# Altium schematic sheet Melon-2.SchDoc
size 594 x 420 mm; ApprovedBy: Лазарев В.П.; DrawnBy: Лазарев В.П.; SheetTotal: 1; PageSetup: Record=PageOptions|CenterHorizontal=True|CenterVertical=True|PrintScale=1.00|XCorrection=1.00|YCorrection=1.00|PrintKind=0|BorderSize=5000000|LeftOffset=0|BottomOffset=0|Orientation=2|PaperLength=1000|PaperWidth=1000|Scale=100|PaperSource=260|PrintQuality=600|MediaType=1|DitherType=10|PaperKind=A3|PrintScaleMode=0
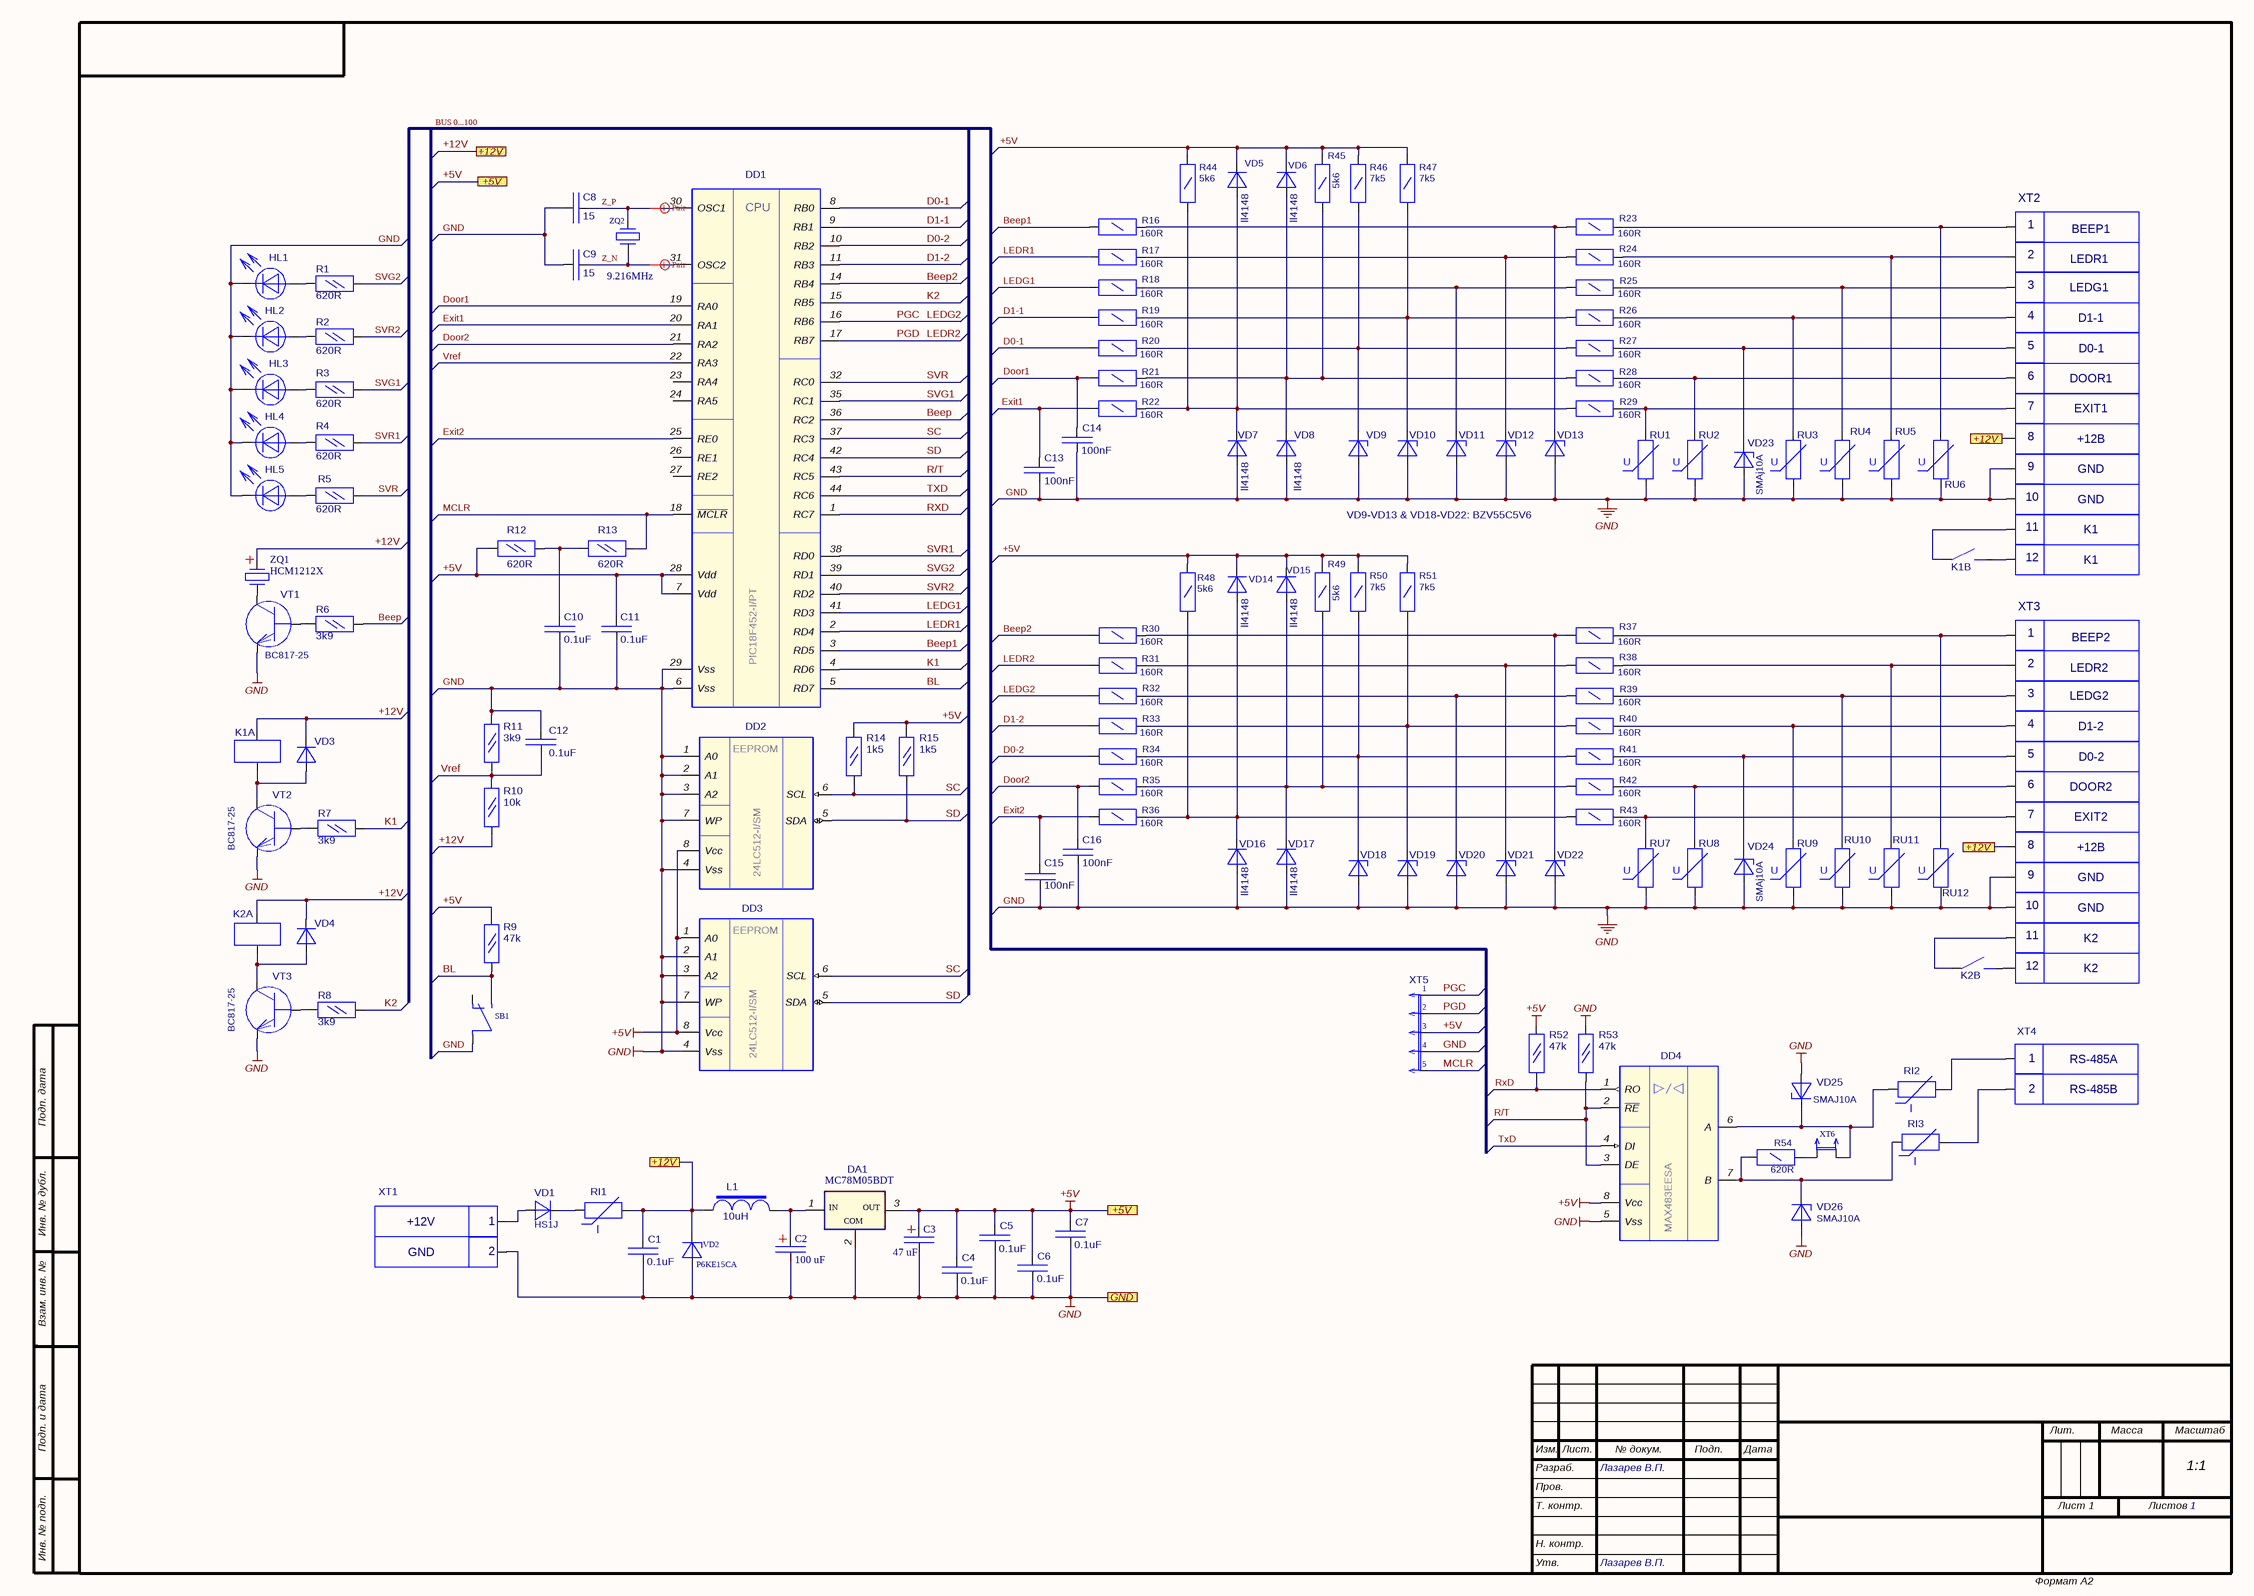
[diagram p0: Melon-2.SchDoc]

## Parts
C1  value 0.1uF  [CAPC2012 (0805)]  (hidden comment: Cap1)
C2  value 100 uF  [CAPR E 6.5x12, pitch 2.5]  (hidden comment: Comment)
C3  value 47 uF  [CAPR E 6.5x12, pitch 2.5]  (hidden comment: Comment)
C4  value 0.1uF  [CAPC2012 (0805)]  (hidden comment: Cap1)
C5  value 0.1uF  [CAPC2012 (0805)]  (hidden comment: Cap1)
C6  value 0.1uF  [CAPC2012 (0805)]  (hidden comment: Cap1)
C7  value 0.1uF  [CAPC2012 (0805)]  (hidden comment: Cap1)
C8  value 15  [1608[0603]]  (hidden comment: Cap_SMD)
C9  value 15  [1608[0603]]  (hidden comment: Cap_SMD)
C10  value 0.1uF  [CAPC2012 (0805)]  (hidden comment: Cap_SMD)
C11  value 0.1uF  [CAPC2012 (0805)]  (hidden comment: Cap_SMD)
C12  value 0.1uF  [1608[0603]]  (hidden comment: Cap_SMD)
C13  value 100nF  [CAPC2012 (0805)]  (hidden comment: Cap1)
C14  value 100nF  [CAPC2012 (0805)]  (hidden comment: Cap1)
C15  value 100nF  [CAPC2012 (0805)]  (hidden comment: Cap1)
C16  value 100nF  [CAPC2012 (0805)]  (hidden comment: Cap1)
DA1  MC78M05BDT  [D3PAK]
DD1  PIC18F452-I/PT  [TQFP-PT44_M]
DD2  24LC512-I/SM  [SO8_W]
DD3  24LC512-I/SM  [SO8_W]
DD4  value MAX483EESA  [SO8_M]  (hidden comment: MAX48xx)
HL1  LED Green  [LED Green smd-1206]  (value not drawn)
HL2  LED Red  [LED Red smd-1206]  (value not drawn)
HL3  LED Green  [LED Green smd-1206]  (value not drawn)
HL4  LED Red  [LED Red smd-1206]  (value not drawn)
HL5  LED Red  [LED Red smd-1206]  (value not drawn)
K1  Relay  [Relay TRC-12VDC-SB-AL]  (value not drawn)  (parts A,B of 2)
K2  Relay  [Relay TRC-12VDC-SB-AL]  (value not drawn)  (parts A,B of 2)
L1  Inductance: 10uH  [Choke SMD 1812]  (hidden comment: Choke SMD)
R1  value 620R  [RESC2012(0805)]  (hidden comment: Res 1/8W)
R2  value 620R  [RESC2012(0805)]  (hidden comment: Res 1/8W)
R3  value 620R  [RESC2012(0805)]  (hidden comment: Res 1/8W)
R4  value 620R  [RESC2012(0805)]  (hidden comment: Res 1/8W)
R5  value 620R  [RESC2012(0805)]  (hidden comment: Res 1/8W)
R6  value 3k9  [RESC2012(0805)]  (hidden comment: Res 1/8W)
R7  value 3k9  [RESC2012(0805)]  (hidden comment: Res 1/8W)
R8  value 3k9  [RESC2012(0805)]  (hidden comment: Res 1/8W)
R9  value 47k  [RESC2012(0805)]  (hidden comment: Res 1/8W)
R10  value 10k  [RESC2012(0805)]  (hidden comment: Res 1/8W)
R11  value 3k9  [RESC2012(0805)]  (hidden comment: Res 1/8W)
R12  value 620R  [RESC2012(0805)]  (hidden comment: Res 1/8W)
R13  value 620R  [RESC2012(0805)]  (hidden comment: Res 1/8W)
R14  value 1k5  [RESC2012(0805)]  (hidden comment: Res 1/8W)
R15  value 1k5  [RESC2012(0805)]  (hidden comment: Res 1/8W)
R16  value 160R  [RESC3216(1206)N]  (hidden comment: Res 1/4W)
R17  value 160R  [RESC3216(1206)N]  (hidden comment: Res 1/4W)
R18  value 160R  [RESC3216(1206)N]  (hidden comment: Res 1/4W)
R19  value 160R  [RESC3216(1206)N]  (hidden comment: Res 1/4W)
R20  value 160R  [RESC3216(1206)N]  (hidden comment: Res 1/4W)
R21  value 160R  [RESC3216(1206)N]  (hidden comment: Res 1/4W)
R22  value 160R  [RESC3216(1206)N]  (hidden comment: Res 1/4W)
R23  value 160R  [RESC3216(1206)N]  (hidden comment: Res 1/4W)
R24  value 160R  [RESC3216(1206)N]  (hidden comment: Res 1/4W)
R25  value 160R  [RESC3216(1206)N]  (hidden comment: Res 1/4W)
R26  value 160R  [RESC3216(1206)N]  (hidden comment: Res 1/4W)
R27  value 160R  [RESC3216(1206)N]  (hidden comment: Res 1/4W)
R28  value 160R  [RESC3216(1206)N]  (hidden comment: Res 1/4W)
R29  value 160R  [RESC3216(1206)N]  (hidden comment: Res 1/4W)
R30  value 160R  [RESC3216(1206)N]  (hidden comment: Res 1/4W)
R31  value 160R  [RESC3216(1206)N]  (hidden comment: Res 1/4W)
R32  value 160R  [RESC3216(1206)N]  (hidden comment: Res 1/4W)
R33  value 160R  [RESC3216(1206)N]  (hidden comment: Res 1/4W)
R34  value 160R  [RESC3216(1206)N]  (hidden comment: Res 1/4W)
R35  value 160R  [RESC3216(1206)N]  (hidden comment: Res 1/4W)
R36  value 160R  [RESC3216(1206)N]  (hidden comment: Res 1/4W)
R37  value 160R  [RESC3216(1206)N]  (hidden comment: Res 1/4W)
R38  value 160R  [RESC3216(1206)N]  (hidden comment: Res 1/4W)
R39  value 160R  [RESC3216(1206)N]  (hidden comment: Res 1/4W)
R40  value 160R  [RESC3216(1206)N]  (hidden comment: Res 1/4W)
R41  value 160R  [RESC3216(1206)N]  (hidden comment: Res 1/4W)
R42  value 160R  [RESC3216(1206)N]  (hidden comment: Res 1/4W)
R43  value 160R  [RESC3216(1206)N]  (hidden comment: Res 1/4W)
R44  value 5k6  [RESC3216(1206)N]  (hidden comment: Res 1/4W)
R45  value 5k6  [RESC3216(1206)N]  (hidden comment: Res 1/4W)
R46  value 7k5  [RESC3216(1206)N]  (hidden comment: Res 1/4W)
R47  value 7k5  [RESC3216(1206)N]  (hidden comment: Res 1/4W)
R48  value 5k6  [RESC3216(1206)N]  (hidden comment: Res 1/4W)
R49  value 5k6  [RESC3216(1206)N]  (hidden comment: Res 1/4W)
R50  value 7k5  [RESC3216(1206)N]  (hidden comment: Res 1/4W)
R51  value 7k5  [RESC3216(1206)N]  (hidden comment: Res 1/4W)
R52  value 47k  [RESC2012(0805)]  (hidden comment: Res 1/8W)
R53  value 47k  [RESC2012(0805)]  (hidden comment: Res 1/8W)
R54  value 620R  [RESC3216(1206)N]  (hidden comment: Res 1/4W)
RI1  MF-MSMF010  [Multy_Fuse 1812]  (value not drawn)
RI2  MF-MSMF010  [Multy_Fuse 1812]  (value not drawn)
RI3  MF-MSMF010  [Multy_Fuse 1812]  (value not drawn)
RU1  Varistor  [CAPC3216N]  (value not drawn)
RU2  Varistor  [CAPC3216N]  (value not drawn)
RU3  Varistor  [CAPC3216N]  (value not drawn)
RU4  Varistor  [CAPC3216N]  (value not drawn)
RU5  Varistor  [CAPC3216N]  (value not drawn)
RU6  Varistor  [CAPC3216N]  (value not drawn)
RU7  Varistor  [CAPC3216N]  (value not drawn)
RU8  Varistor  [CAPC3216N]  (value not drawn)
RU9  Varistor  [CAPC3216N]  (value not drawn)
RU10  Varistor  [CAPC3216N]  (value not drawn)
RU11  Varistor  [CAPC3216N]  (value not drawn)
RU12  Varistor  [CAPC3216N]  (value not drawn)
SB1  SW-2WAY_Gost  [PLS 2pin]  (value not drawn)
VD1  value HS1J  [CD4532-1812 (mod)]  (hidden comment: Diode1)
VD2  value P6KE15CA  [DO-15 -12.5mm Pitch]  (hidden comment: Diode P6KE15CA)
VD3  Diode LL4148  [MELF-D3516-1406]  (value not drawn)
VD4  Diode LL4148  [MELF-D3516-1406]  (value not drawn)
VD5  value ll4148  [MELF-D3516-1406]  (hidden comment: Diode LL4148)
VD6  value ll4148  [MELF-D3516-1406]  (hidden comment: Diode LL4148)
VD7  value ll4148  [MELF-D3516-1406]  (hidden comment: Diode LL4148)
VD8  value ll4148  [MELF-D3516-1406]  (hidden comment: Diode LL4148)
VD9  Diode Zener  [SOD80 (miniMELF]  (value not drawn)
VD10  Diode Zener  [SOD80 (miniMELF]  (value not drawn)
VD11  Diode Zener  [SOD80 (miniMELF]  (value not drawn)
VD12  Diode Zener  [SOD80 (miniMELF]  (value not drawn)
VD13  Diode Zener  [SOD80 (miniMELF]  (value not drawn)
VD14  value ll4148  [MELF-D3516-1406]  (hidden comment: Diode LL4148)
VD15  value ll4148  [MELF-D3516-1406]  (hidden comment: Diode LL4148)
VD16  value ll4148  [MELF-D3516-1406]  (hidden comment: Diode LL4148)
VD17  value ll4148  [MELF-D3516-1406]  (hidden comment: Diode LL4148)
VD18  Diode Zener  [SOD80 (miniMELF]  (value not drawn)
VD19  Diode Zener  [SOD80 (miniMELF]  (value not drawn)
VD20  Diode Zener  [SOD80 (miniMELF]  (value not drawn)
VD21  Diode Zener  [SOD80 (miniMELF]  (value not drawn)
VD22  Diode Zener  [SOD80 (miniMELF]  (value not drawn)
VD23  value SMAj10A  [SMA (DO-214AC)]  (hidden comment: Diode Zener)
VD24  value SMAj10A  [SMA (DO-214AC)]  (hidden comment: Diode Zener)
VD25  value SMAJ10A  [SMA (DO-214AC)]  (hidden comment: Diode Zener)
VD26  value SMAJ10A  [SMA (DO-214AC)]  (hidden comment: Diode Zener)
VT1  value BC817-25  [SOT-23_3D]  (hidden comment: BC847)
VT2  value BC817-25  [SOT-23_3D]  (hidden comment: BC847)
VT3  value BC817-25  [SOT-23_3D]  (hidden comment: BC847)
X2.2  Connect x2_1  [ZIP-Ballast2 - screw 3.5]  (value not drawn)
XT1  Connect x2_1  [ZIP-Ballast2]  (value not drawn)
XT2  Connect x2_1  [ZIP-Ballast2 - screw 3.5]  (value not drawn)
XT2.1  Connect x2_1  [ZIP-Ballast2 - screw 3.5]  (value not drawn)
XT2.3  Connect x2_1  [ZIP-Ballast2 - screw 3.5]  (value not drawn)
XT2.4  Connect x2_1  [ZIP-Ballast2 - screw 3.5]  (value not drawn)
XT2.5  Connect x2_1  [ZIP-Ballast2]  (value not drawn)
XT3  Connect x2_1  [ZIP-Ballast2 - screw 3.5]  (value not drawn)
XT3.1  Connect x2_1  [ZIP-Ballast2 - screw 3.5]  (value not drawn)
XT3.2  Connect x2_1  [ZIP-Ballast2 - screw 3.5]  (value not drawn)
XT3.3  Connect x2_1  [ZIP-Ballast2 - screw 3.5]  (value not drawn)
XT3.4  Connect x2_1  [ZIP-Ballast2 - screw 3.5]  (value not drawn)
XT3.5  Connect x2_1  [ZIP-Ballast2]  (value not drawn)
XT4  Connect x2_1  [ZIP-Ballast2 - screw 3.5]  (value not drawn)
XT5  Connect x5  [Connector PLS 5pin]  (value not drawn)
XT6  Connect x2  [PLS 2pin]  (value not drawn)
ZQ1  value HCM1212X  [HCM1606X]  (hidden comment: Buzzer)
ZQ2  value 9.216MHz  [HC-49sm]  (hidden comment: XTAL_1)

## Ports
+5V, +12V, GND

## Nets
+5V: C3.1 C4.2 C5.2 C6.2 C7.2 C11.2 DA1.3(OUT) DD1.7(Vdd) DD1.28(Vdd) DD2.8(Vcc) DD3.1(A0) DD3.8(Vcc) DD4.8(Vcc) R9.1 R12.2 R14.1 R15.1 R44.1 R45.1 R46.1 R47.1 R48.1 R49.1 R50.1 R51.1 R52.1 VD5.2 VD6.2 VD14.2 VD15.2 XT5.3 ; port +5V
GND: C1.1 C2.2 C3.2 C4.1 C5.1 C6.1 C7.1 C8.1 C9.1 C10.1 C11.1 C12.1 C13.1 C14.1 C15.1 C16.1 DA1.2(COM) DD1.6(Vss) DD1.29(Vss) DD2.1(A0) DD2.2(A1) DD2.3(A2) DD2.4(Vss) DD2.7(WP) DD3.2(A1) DD3.3(A2) DD3.4(Vss) DD3.7(WP) DD4.5(Vss) HL1.2 HL2.2 HL3.2 HL4.2 HL5.2 R11.1 R53.1 RU1.1 RU2.1 RU3.1 RU4.1 RU5.1 RU6.1 RU7.1 RU8.1 RU9.1 RU10.1 RU11.1 RU12.1 SB1.1(C) VD2.1 VD7.1 VD8.1 VD9.1 VD10.1 VD11.1 VD12.1 VD13.1 VD16.1 VD17.1 VD18.1 VD19.1 VD20.1 VD21.1 VD22.1 VD23.1 VD24.1 VD25.1 VD26.1 VT1.2(E) VT2.2(E) VT3.2(E) XT1.1 XT2.4.1 XT2.4.2 XT3.4.1 XT3.4.2 XT5.4 ; port GND
+12V: C1.2 K1.4 K2.4 L1.2 R10.2 RI1.1 VD2.2 VD3.2 VD4.2 XT2.3.2 XT3.3.2 ZQ1.1(OSC1) ; port +12V
Beep: DD1.36(RC2) R6.2
Beep1: DD1.3(RD5) R16.2
Beep2: DD1.14(RB4) R30.2
BL: DD1.5(RD7) R9.2 SB1.2(NO)
D0-1: DD1.8(RB0) R20.2
D0-2: DD1.10(RB2) R34.2
D1-1: DD1.9(RB1) R19.2
D1-2: DD1.11(RB3) R33.2
Door1: C14.2 DD1.19(RA0) R21.2
Door2: C16.2 DD1.21(RA2) R35.2
Exit1: C13.2 DD1.20(RA1) R22.2
Exit2: C15.2 DD1.25(RE0) R36.2
K1: DD1.4(RD6) R7.2
K2: DD1.15(RB5) R8.2
LEDG1: DD1.41(RD3) R18.2
LEDG2: DD1.16(RB6) R32.2 XT5.1  [also labelled PGC]
LEDR1: DD1.2(RD4) R17.2
LEDR2: DD1.17(RB7) R31.2 XT5.2  [also labelled PGD]
MCLR: DD1.18(~{MCLR}) R13.1 XT5.5
R/T: DD1.43(RC5) DD4.2(~{RE}) DD4.3(DE) R53.2
RXD: DD1.1(RC7) DD4.1(RO) R52.2
SC: DD1.37(RC3) DD2.6(SCL) DD3.6(SCL) R14.2
SD: DD1.42(RC4) DD2.5(SDA) DD3.5(SDA) R15.2
SVG1: DD1.35(RC1) R3.2
SVG2: DD1.39(RD1) R1.2
SVR: DD1.32(RC0) R5.2
SVR1: DD1.38(RD0) R4.2
SVR2: DD1.40(RD2) R2.2
TXD: DD1.44(RC6) DD4.4(DI)
Vref: C12.2 DD1.22(RA3) R10.1 R11.2
Z_N: C9.2 DD1.31(OSC2) ZQ2.1(OSC1)
Z_P: C8.2 DD1.30(OSC1) ZQ2.2(OSC2)
NetC2_1: C2.1 DA1.1(IN) L1.1
NetC10_2: C10.2 R12.1 R13.2
NetDD4_6: DD4.6(A) RI2.2 VD25.2 XT6.1
NetDD4_7: DD4.7(B) R54.2 RI3.2 VD26.2
NetHL1_1: HL1.1 R1.1
NetHL2_1: HL2.1 R2.1
NetHL3_1: HL3.1 R3.1
NetHL4_1: HL4.1 R4.1
NetHL5_1: HL5.1 R5.1
NetK1_1: K1.1 XT2.5.1
NetK1_2: K1.2 XT2.5.2
NetK1_3: K1.3 VD3.1 VT2.3(C)
NetK2_1: K2.1 XT3.5.1
NetK2_2: K2.2 XT3.5.2
NetK2_3: K2.3 VD4.1 VT3.3(C)
NetR6_1: R6.1 VT1.1(B)
NetR7_1: R7.1 VT2.1(B)
NetR8_1: R8.1 VT3.1(B)
NetR16_1: R16.1 R23.2 VD13.2
NetR17_1: R17.1 R24.2 VD12.2
NetR18_1: R18.1 R25.2 VD11.2
NetR19_1: R19.1 R26.2 R47.2 VD10.2
NetR20_1: R20.1 R27.2 R46.2 VD9.2
NetR21_1: R21.1 R28.2 R45.2 VD6.1 VD8.2
NetR22_1: R22.1 R29.2 R44.2 VD5.1 VD7.2
NetR23_1: R23.1 RU6.2 XT2.1
NetR24_1: R24.1 RU5.2 XT2.2
NetR25_1: R25.1 RU4.2 XT2.1.1
NetR26_1: R26.1 RU3.2 XT2.1.2
NetR27_1: R27.1 VD23.2 X2.2.1
NetR28_1: R28.1 RU2.2 X2.2.2
NetR29_1: R29.1 RU1.2 XT2.3.1
NetR30_1: R30.1 R37.2 VD22.2
NetR31_1: R31.1 R38.2 VD21.2
NetR32_1: R32.1 R39.2 VD20.2
NetR33_1: R33.1 R40.2 R51.2 VD19.2
NetR34_1: R34.1 R41.2 R50.2 VD18.2
NetR35_1: R35.1 R42.2 R49.2 VD15.1 VD17.2
NetR36_1: R36.1 R43.2 R48.2 VD14.1 VD16.2
NetR37_1: R37.1 RU12.2 XT3.1
NetR38_1: R38.1 RU11.2 XT3.2
NetR39_1: R39.1 RU10.2 XT3.1.1
NetR40_1: R40.1 RU9.2 XT3.1.2
NetR41_1: R41.1 VD24.2 XT3.2.1
NetR42_1: R42.1 RU8.2 XT3.2.2
NetR43_1: R43.1 RU7.2 XT3.3.1
NetR54_1: R54.1 XT6.2
NetRI1_2: RI1.2 VD1.2
NetRI2_1: RI2.1 XT4.1
NetRI3_1: RI3.1 XT4.2
NetVD1_1: VD1.1 XT1.2
NetVT1_3: VT1.3(C) ZQ1.2(OSC2)

Not connected (* = marked no-connect by the designer): DD1 23(RA4) 24(RA5) 26(RE1) 27(RE2); SB1 3(NC)

## Buses and harness runs
bus BUS 0...100

## Layout directives
differential pair: Z_N, Z_P

## Notes on the sheet
- (near XT2) 1
- (near XT2) 2
- LEDR1
- BEEP1
- (near XT2.1) 3
- LEDG1
- D1-1
- (near XT2.1) 4
- (near X2.2) 5
- D0-1
- (near X2.2) 6
- (near XT2.3) 7
- EXIT1
- DOOR1
- (near XT2.3) 8
- +12B
- (near XT2.4) 10
- (near XT2.4) 9
- GND
- VD9-VD13 & VD18-VD22: BZV55C5V6
- (near XT2.5) 11
- K1
- (near XT2.5) 12
- (near XT3) 1
- BEEP2
- (near XT3) 2
- (near XT3.1) 3
- LEDG2
- LEDR2
- (near XT3.1) 4
- D1-2
- (near XT3.2) 5
- (near XT3.2) 6
- DOOR2
- D0-2
- (near XT3.3) 7
- EXIT2
- (near XT3.3) 8
- (near XT3.4) 9
- (near XT3.4) 10
- (near XT3.5) 11
- K2
- (near XT3.5) 12
- (near XT4) 1
- RS-485A
- (near XT4) 2
- RS-485B
- +12V
- (near XT1) 1
- (near XT1) 2
- Подп. дата
- Инв. № дубл.
- Взам. инв. №
- Подп. и дата
- Изм.
- Лист.
- № докум.
- Подп.
- Дата
- Лит.
- Масса
- Масштаб
- Разраб.
- Пров.
- Т. контр.
- Лист 1
- Листов
- 1:1
- Инв. № подп.
- Н. контр.
- Утв.
- Формат А2
- (in symbol PIC18F452-I/PT) CPU
- (in symbol Varistor) U

## Library data of the parts
C1 C4-C7 = Cap1: Capacitor GOST; Voltage: 100 V; Function: CVCC; Dielectric: Y5V; Tolerance: 5%/10%; PackageDescription: Chip Capasitor; Package Reference: C0805
C2 = Cap Pol: Cap Pol GOST; Tolerance: 10%; Function: Electrolytic Aluminum Capasitor; Voltage: 35V; Supplier: *; PackageDescription: Radial, Thru-Hole Body 13.0x25.0 (DxH)mm, Pin Spacing 5.0mm
C3 = Cap Pol: Cap Pol GOST; Tolerance: 10%; Function: Electrolytic Aluminum Capasitor; Voltage: 16V; Supplier: *; PackageDescription: Radial, Thru-Hole Body 13.0x25.0 (DxH)mm, Pin Spacing 5.0mm
C8 C9 = Cap_SMD: Ceramic; Voltage: 15V; Tolerance %: 1%; Dielectric: NPO; Value2: 220-470nF; PackageDescription: SMD CC0603; Function: *; Supplier: *; Supplier Part Number: *
C10-C12 = Cap_SMD: Ceramic; Voltage: 15V; Tolerance %: 10%; Dielectric: Y5V; Value2: 220-470nF; Function: *; Supplier: *; Supplier Part Number: *
  C10 C11: PackageDescription: SMD CC0805
  C12: PackageDescription: SMD CC0603
C13-C16 = Cap1: Capacitor GOST; Voltage: 100 V; Function: CVCC; Dielectric: X7R; Tolerance: 5%/10%; PackageDescription: Chip Capasitor; Package Reference: C0805
DA1 = MC78M05BDT: Voltage Regulator Gost; Functuion: Positive Voltage Regulator; Value: MC78M05BDT; PackageReference: *
DD1 = PIC18F452-I/PT: 44pin TQFP; Functuion: MCU; PackageReference: TQFP; Supplier 1: Microchip Technology Inc; Value: PIC18F452-I/PT
DD2 DD3 = 24LC512-I/SM: Function: EEPROM; Supplier: Microchip Technology Inc; Value: 24LC512-I/SM
DD4 = MAX48xx: MAX483EESA; Function: RS485 Transceiver; PackageReference: SO-8
HL1 HL3 = LED Green: LED Gost; Value: KA-3021SGC; PackageDescription: SMD 2x3mm; Color: Green
HL2 HL4 HL5 = LED Red: LED Gost; Value: KA-3021SRC; PackageDescription: SMD 2x3mm; Color: Red
K1 K2 = Relay: TRC-12VDC-FB-AL; Function: Relay 1 pole; Value: TRC-12VDC-SB-AL
L1 = Choke SMD: Value: CM453232-100KL; Function: Choke; Package: SMD 1812
R1-R5 R9 R12 R13 R52 R53 = Res 1/8W: Resistor GOST; Tolerance: 10%; PackageDescription: Chip Resistor, Body 2.0x1.3mm,; PackageReference: *; Part Number: *
R6-R8 R10 R11 R14 R15 = Res 1/8W: Resistor GOST; Tolerance: 1%; PackageDescription: Chip Resistor, Body 2.0x1.3mm,; PackageReference: *; Part Number: *
R16-R51 R54 = Res 1/4W: Resistor GOST; PackageDescription: SMD 2106; Function: *; Part Number: *
RI1 = MF-MSMF010: MultiFuse; Value: MF-MSMF110; Current hold: 200 mA; Function: MultiFuse; Package: SMD 1812
RI2 RI3 = MF-MSMF010: MultiFuse; Current hold: 100 mA; Function: MultiFuse; Value: MF-MSMF010; Package: SMD 1812
RU1-RU12 = Varistor: Varistor GOST; Value: CN1812K30G; PackageReference: *; PackageDescription: SMD 1812; Part Number: *; Function: Varistor
SB1 = SW-2WAY_Gost: SM-07-P (PRESSED); Value: *
VD1 = Diode1: Diode GOST; Part Number: *; PackageDescription: Chip Diode; Body 4.5 x 3.2 mm (LxW typ); PackageReference: *; Function: *
VD2 = Diode P6KE15CA: Diode Suppressor; Function: TVS Diode; PackageReference: *; PackageDescription: DO-15; Part Number: *
VD3-VD8 VD14-VD17 = Diode LL4148: Diode LL4148 (GOST); Package Description: miniMELF (SOD-80); Part Number: *; Function: *
  VD3 VD4: Value: ll4148
VD9-VD13 VD18-VD22 = Diode Zener: Diode Zener GOST; Function: Zener Diod 5V6; Value: BZV55C5V6; Part Number: *; PackageReference: *; PackageDescription: miniMELF (SOD-80)
VD23-VD26 = Diode Zener: Diode Zener GOST; Function: TVS Diode; Part Number: *; PackageReference: *; PackageDescription: SMA/DO-214AC
VT1-VT3 = BC847: NPN_SOT23; Functioun: Bipolar NPN; Vceo=40V; Ic=600mA; PackageDescription: SOT-23; PackageReference: *; Part Number: *
X2.2 XT1 XT2 XT2.1 XT2.3-XT2.5 XT3 XT3.1-XT3.5 XT4 = Connect x2_1: Connect x2 GOST
XT5 = Connect x5: PLS 5 pin; Package: PLS 5pin
XT6 = Connect x2: PLS 2 pin
ZQ1 = Buzzer: Sound Buzzer
ZQ2 = XTAL_1: Crystal Oscillator_Gost; PackageReference: HC-49sm